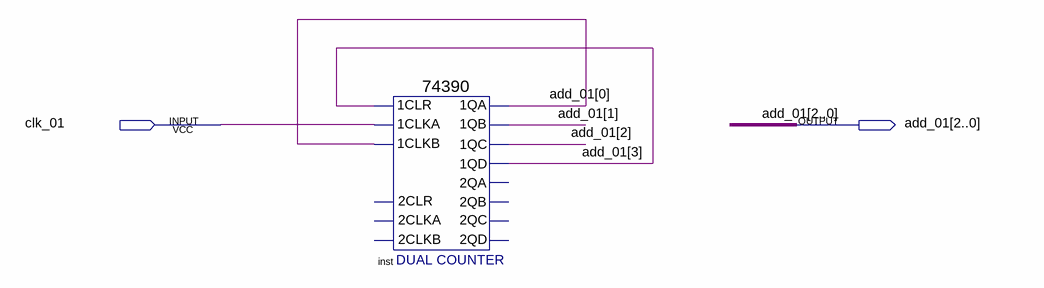
[diagram p0: schematic sheet]
// Quartus schematic cnt8.bdf as structural Verilog: 1 symbols, 2 pins
module cnt8 (
  input  clk_01,
  output [3:0] add_01
);

  \74390  inst (
    .\1CLR (add_01[3]), .\1CLKA (clk_01), .\1CLKB (add_01[0]), .\1QA (add_01[0]), .\1QB (add_01[1]),
    .\1QC (add_01[2]), .\1QD (add_01[3]));  // open: 2CLKA, 2CLR, 2CLKB, 2QA, 2QB, 2QC, 2QD
endmodule
